# EAGLE design stm32-shield (EAGLE 9.6.2)
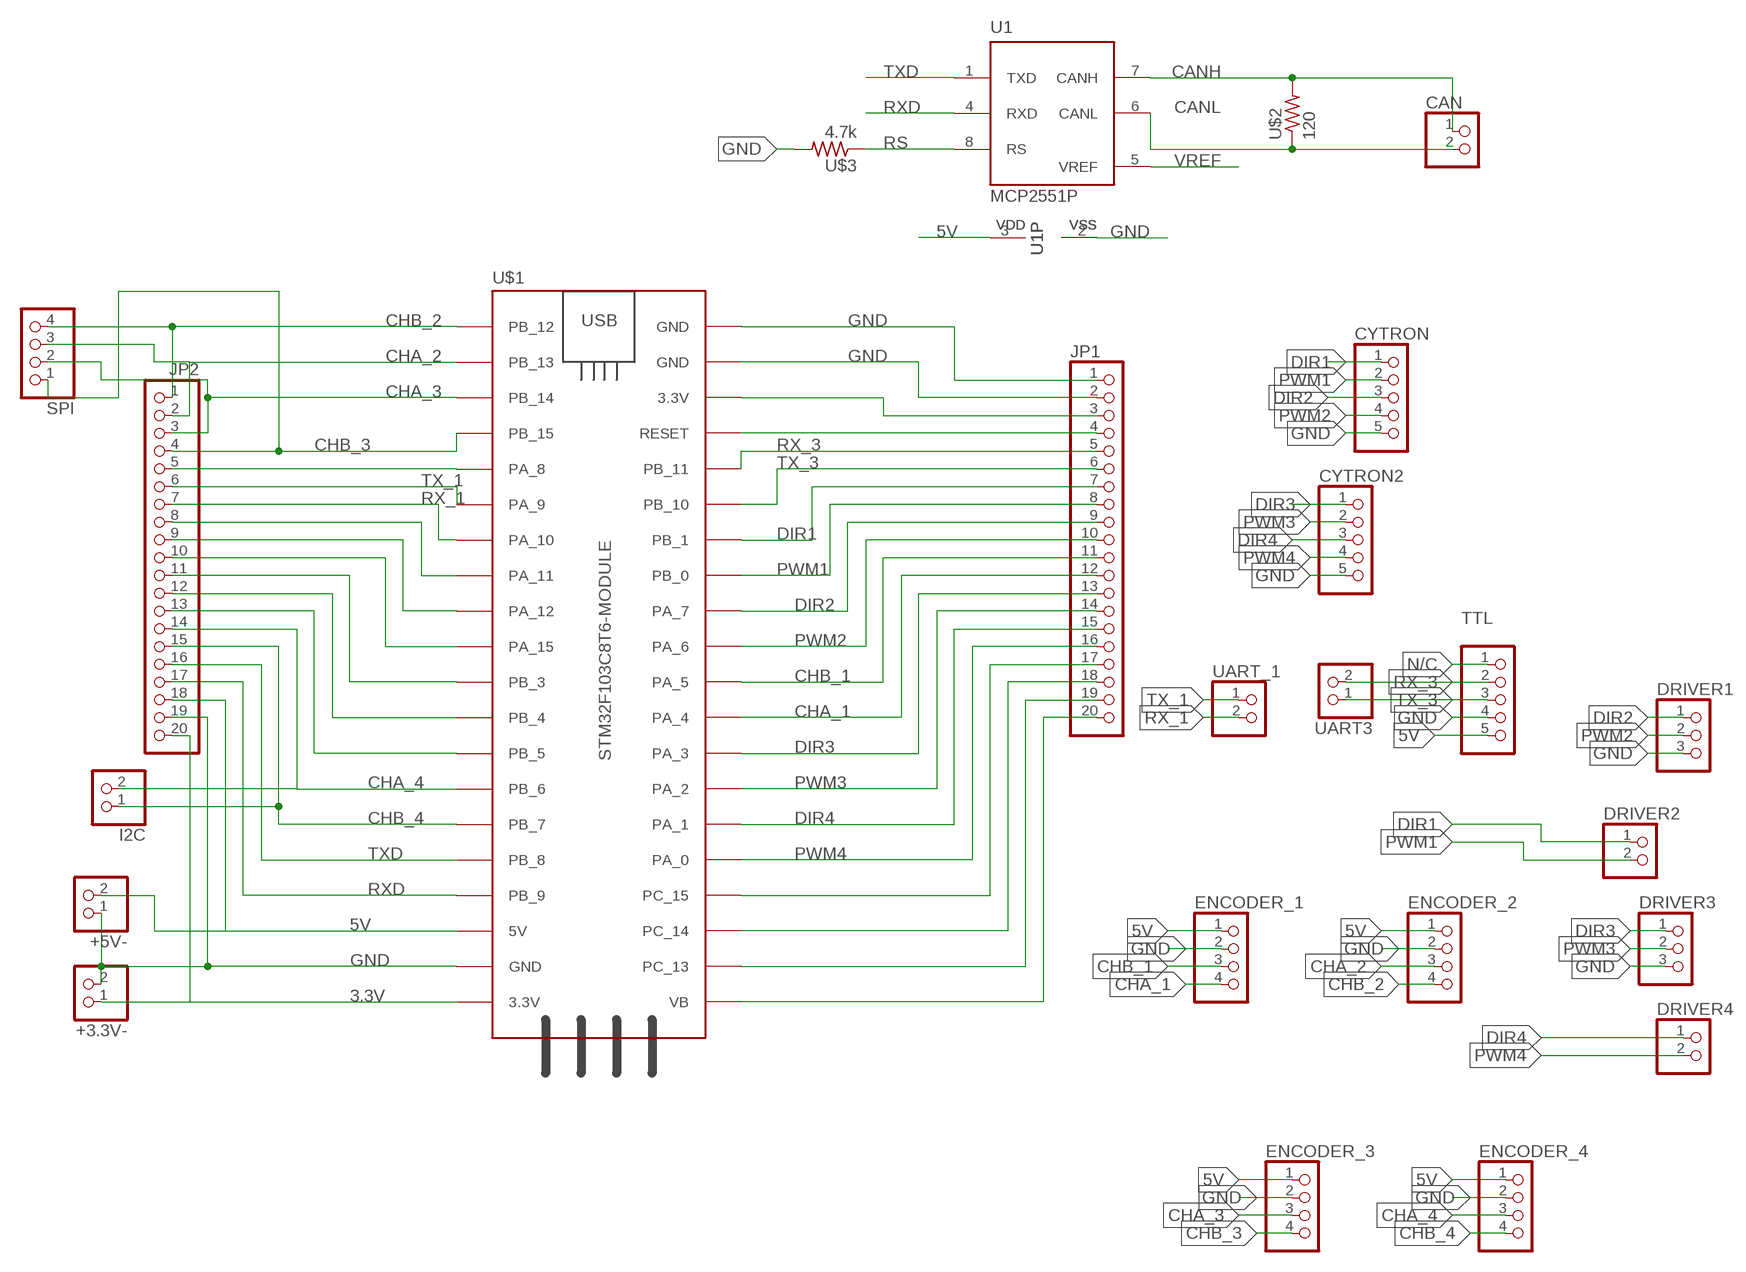
[diagram p0: schematic, sheet 1]

## Parts
+3.3V-  PINHD-2_DATA  [1X02_DATA]
+5V-  PINHD-2_DATA  [1X02_DATA]
CAN  PINHD-2_DATA  [1X02_DATA]
CYTRON  PINHD-5_DATA  [1X05_DATA]
CYTRON2  PINHD-5_DATA  [1X05_DATA]
DRIVER1  PINHD-3_DATA  [1X03_DATA]
DRIVER2  PINHD-2_DATA  [1X02_DATA]
DRIVER3  PINHD-3_DATA  [1X03_DATA]
DRIVER4  PINHD-2_DATA  [1X02_DATA]
ENCODER_1  PINHD-4_DATA  [1X04_DATA]
ENCODER_2  PINHD-4_DATA  [1X04_DATA]
ENCODER_3  PINHD-4_DATA  [1X04_DATA]
ENCODER_4  PINHD-4_DATA  [1X04_DATA]
I2C  PINHD-2_DATA  [1X02_DATA]
JP1  PINHD-1X20  [1X20]
JP2  PINHD-1X20  [1X20]
SPI  PINHD-4_DATA  [1X04_DATA]
TTL  PINHD-5_DATA  [1X05_DATA]
U1  MCP2551P  [DIL8]
U$1  STM32F103C8T6-MODULE  [STM32F103C8T6-MODULE]
U$2  120  RES-7  [0204/7]
U$3  4.7k  RES-7  [0204/7]
UART3  PINHD-2_DATA  [1X02_DATA]
UART_1  PINHD-2_DATA  [1X02_DATA]

## Nets
3.3V: +3.3V-.1 JP2.20 U$1.3.3V_1(3.3V)
5V: +5V-.2 ENCODER_1.1 ENCODER_2.1 ENCODER_3.1 ENCODER_4.1 JP2.18 TTL.5 U1.3(VDD) U$1.5V
ADADA: JP2.5 U$1.PA_8
ARQRQ: JP2.13 U$1.PB_5
CANH: CAN.1 U1.7(CANH) U$2.2
CANL: CAN.2 U1.6(CANL) U$2.1
CHA_1: ENCODER_1.4 JP1.12 U$1.PA_4
CHA_2: ENCODER_2.3 JP2.2 SPI.3 U$1.PB_13
CHA_3: ENCODER_3.3 JP2.3 SPI.2 U$1.PB_14
CHA_4: ENCODER_4.3 I2C.2 JP2.14 U$1.PB_6
CHB_1: ENCODER_1.3 JP1.11 U$1.PA_5
CHB_2: ENCODER_2.4 JP2.1 SPI.4 U$1.PB_12
CHB_3: ENCODER_3.4 JP2.4 SPI.1 U$1.PB_15
CHB_4: ENCODER_4.4 I2C.1 JP2.15 U$1.PB_7
DIR1: CYTRON.1 DRIVER2.1 JP1.7 U$1.PB_1
DIR2: CYTRON.3 DRIVER1.1 JP1.9 U$1.PA_7
DIR3: CYTRON2.1 DRIVER3.1 JP1.13 U$1.PA_3
DIR4: CYTRON2.3 DRIVER4.1 JP1.15 U$1.PA_1
GND: +3.3V-.2 +5V-.1 CYTRON2.5 CYTRON.5 DRIVER1.3 DRIVER3.3 ENCODER_1.2 ENCODER_2.2 ENCODER_3.2 ENCODER_4.2 JP1.1 JP1.2 JP2.19 TTL.4 U1.2(VSS) U$1.GND_1(GND) U$1.GND_2(GND) U$1.GND_3(GND) U$3.2
N$3: JP1.3 U$1.3.3V_2(3.3V)
N$4: JP1.4 U$1.RESET
N$17: JP1.17 U$1.PC_15
N$18: JP1.18 U$1.PC_14
N$19: JP1.19 U$1.PC_13
N$20: JP1.20 U$1.VB
N$28: JP2.8 U$1.PA_11
N$29: JP2.9 U$1.PA_12
N$30: JP2.10 U$1.PA_15
N$31: JP2.11 U$1.PB_3
N$32: JP2.12 U$1.PB_4
N/C: TTL.1
PWM1: CYTRON.2 DRIVER2.2 JP1.8 U$1.PB_0
PWM2: CYTRON.4 DRIVER1.2 JP1.10 U$1.PA_6
PWM3: CYTRON2.2 DRIVER3.2 JP1.14 U$1.PA_2
PWM4: CYTRON2.4 DRIVER4.2 JP1.16 U$1.PA_0
RS: U1.8(RS) U$3.1
RX_1: JP2.7 U$1.PA_10 UART_1.2
RX_3: JP1.5 TTL.2 U$1.PB_11 UART3.2
RXD: JP2.17 U1.4(RXD) U$1.PB_9
TX_1: JP2.6 U$1.PA_9 UART_1.1
TX_3: JP1.6 TTL.3 U$1.PB_10 UART3.1
TXD: JP2.16 U1.1(TXD) U$1.PB_8
VREF: U1.5(VREF)

## Library data of the parts
+3.3V- +5V- CAN DRIVER2 DRIVER4 I2C UART3 UART_1 = MIA_LIBRARY-2-2-2:PINHD-2_DATA: PIN HEADER
CYTRON CYTRON2 TTL = MIA_LIBRARY-2-2-2:PINHD-5_DATA: PIN HEADER
DRIVER1 DRIVER3 = MIA_LIBRARY-2-2-2:PINHD-3_DATA: PIN HEADER
ENCODER_1-ENCODER_4 SPI = MIA_LIBRARY-2-2-2:PINHD-4_DATA: PIN HEADER
JP1 JP2 = pinhead:PINHD-1X20: PIN HEADER
U1 = MIA_LIBRARY-2-2-2:MCP2551: High Speed CAN tranceiver
U$1 = MIA_LIBRARY-2-2-2:STM32F103C8T6-MODULE: STM32F103C8T6 module with ARM Cortex-3, 20kB SRAM, 64kB Flash, 72MHz
U$2 U$3 = MIA_LIBRARY-2-2-2:RES-7

## Board
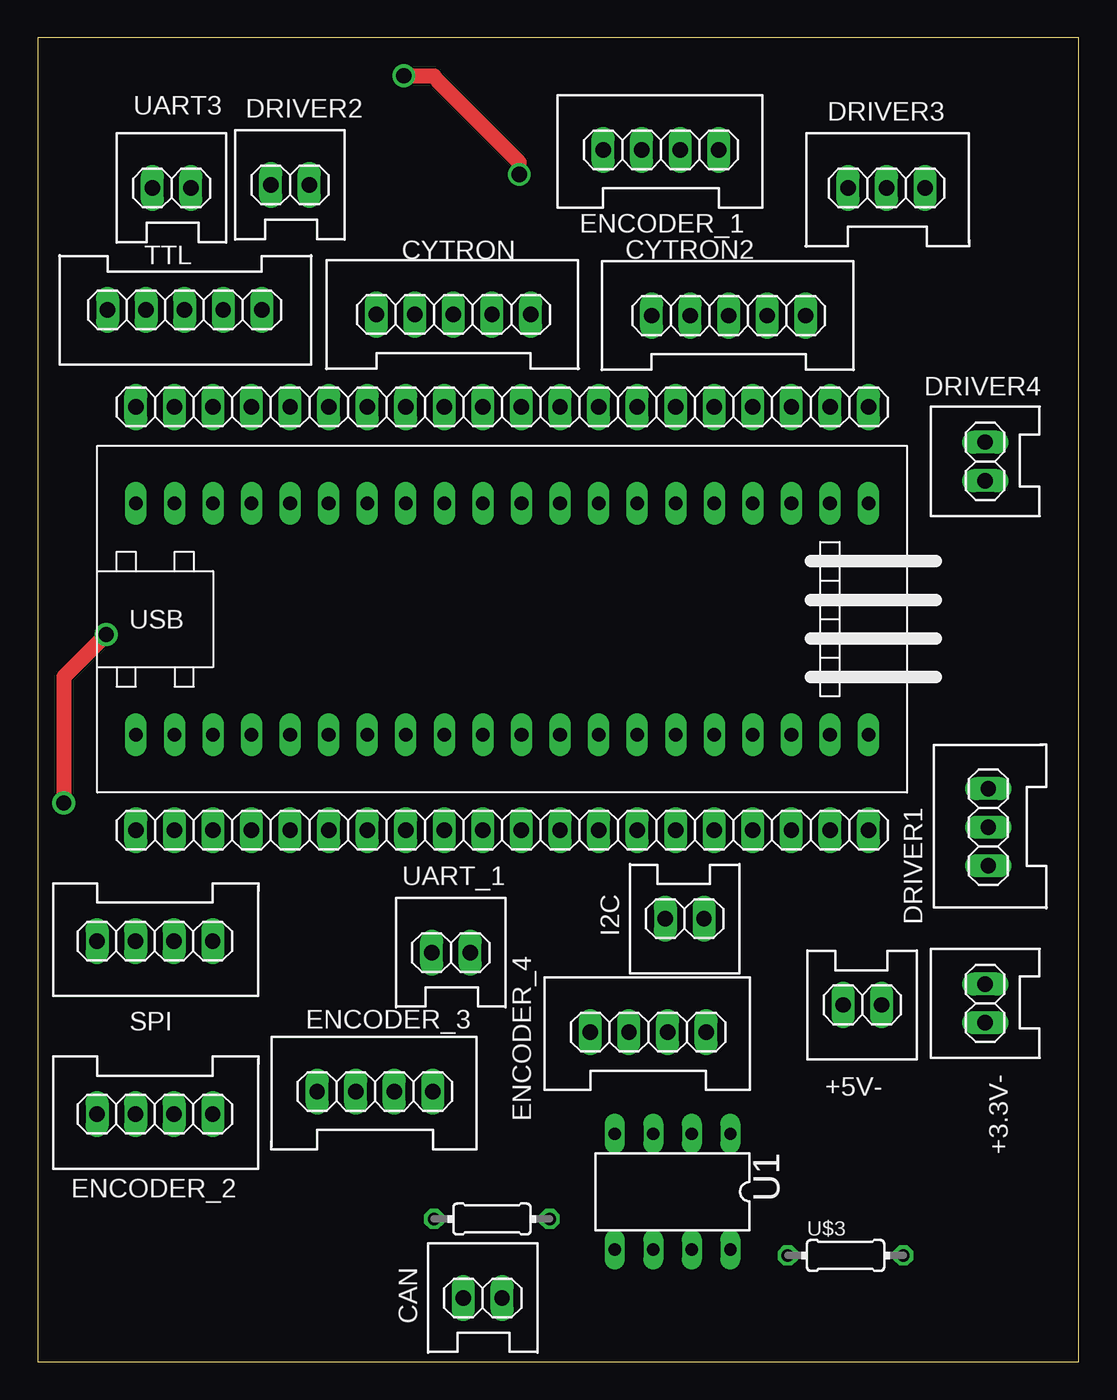
[diagram p1: board, top side]
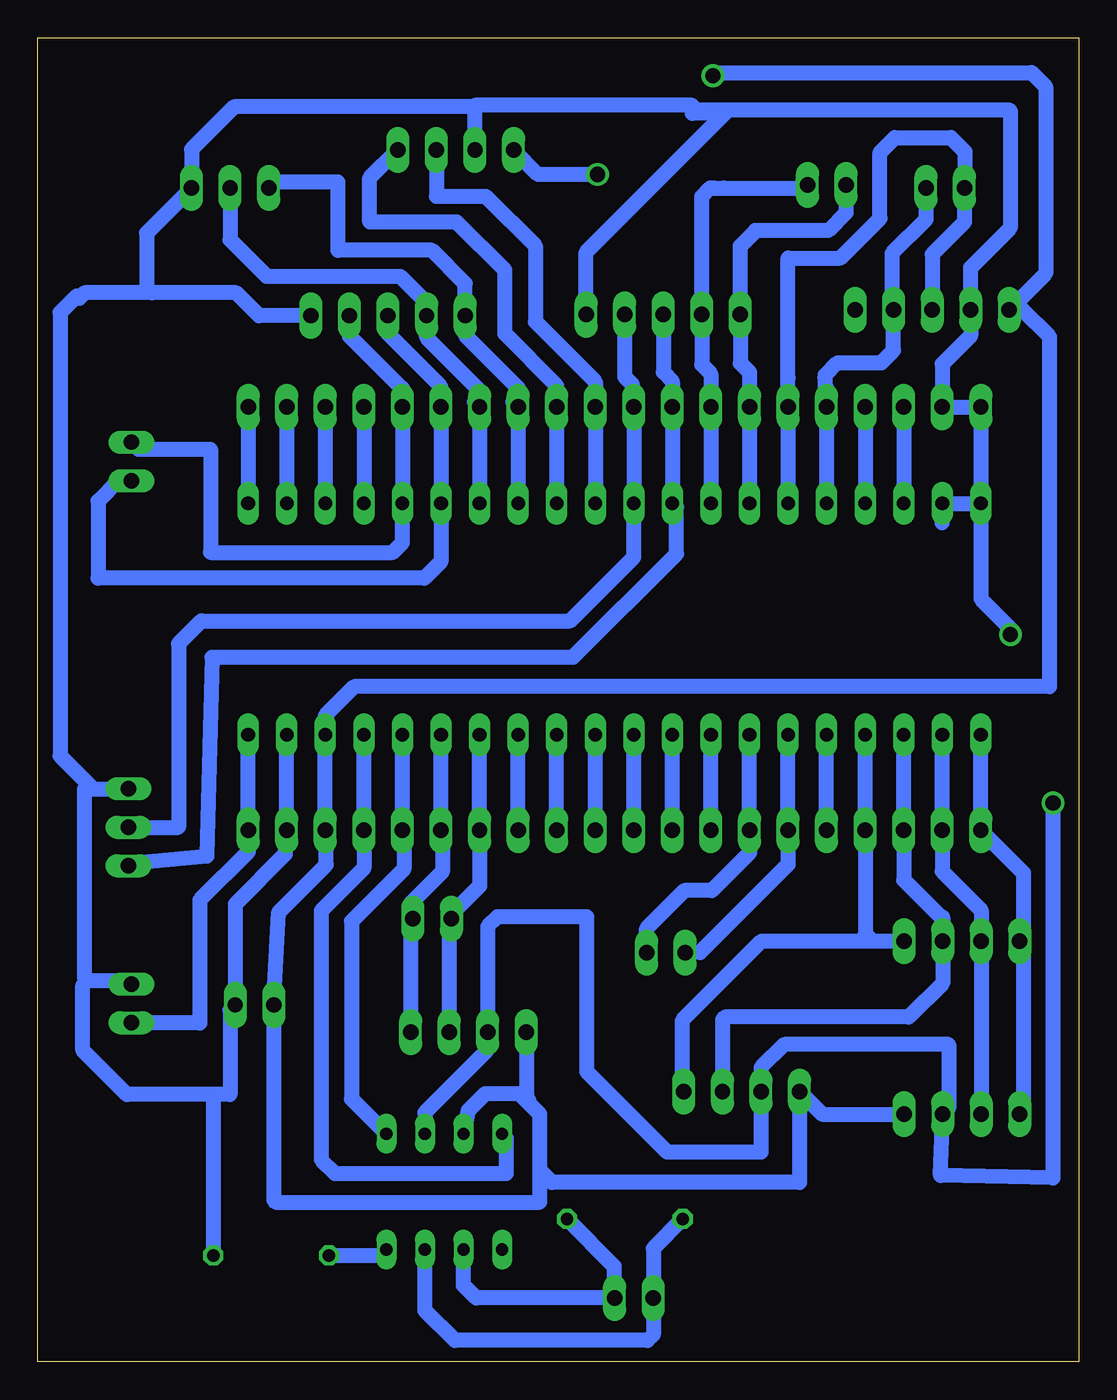
[diagram p2: board, bottom side, seen from below]

Size 68.56 x 87.18 mm. Coordinates in mm from the lower left corner, seen from the top.
Outline: 0,0 68.56,0 68.56,87.18 0,87.18 0,0
Copper layers (1*16): Top 0.035mm / dielectric 1.5mm / Bottom 0.035mm
Design rules "default *": minimum track width 1mm, minimum drill 1mm, track to track 0.8mm, track to pad 0.8mm, pad to pad 6mil, via to via 6mil, smd to smd 6mil, copper to edge 0.8mm, drill to drill 0.8mm, minimum pad ring 10mil, minimum via ring 8mil, stop-mask expansion 4mil, vias tented up to drill 0mil, thermal gap 10mil

### Footprints (pad centres in the part's own frame; a part is rotated, then mirrored left to right if it is on the bottom)
1X02_DATA = drill 1.016 long: 1 -1.27,0; 2 1.27,0
1X05_DATA = drill 1.016 long: 1 -5.08,0; 2 -2.54,0; 3 0,0; 4 2.54,0; 5 5.08,0
1X03_DATA = drill 1.016 long: 1 -2.54,0; 2 0,0; 3 2.54,0
1X04_DATA = drill 1.016 long: 1 -3.81,0; 2 -1.27,0; 3 1.27,0; 4 3.81,0
1X20 = drill 1.016 long: 1 -24.13,0; 2 -21.59,0; 3 -19.05,0; 4 -16.51,0; 5 -13.97,0; 6 -11.43,0; 7 -8.89,0; 8 -6.35,0; 9 -3.81,0; 10 -1.27,0; 11 1.27,0; 12 3.81,0; 13 6.35,0; 14 8.89,0; 15 11.43,0; 16 13.97,0; 17 16.51,0; 18 19.05,0; 19 21.59,0; 20 24.13,0
DIL8 = drill 0.813 long: 1 -3.81,-3.81; 2 -1.27,-3.81; 3 1.27,-3.81; 4 3.81,-3.81; 5 3.81,3.81; 6 1.27,3.81; 7 -1.27,3.81; 8 -3.81,3.81
STM32F103C8T6-MODULE = drill 0.9 long: 3.3V_1 25.4,-7.62; 3.3V_2 -17.78,7.62; 5V 20.32,-7.62; GND_1 22.86,-7.62; GND_2 -20.32,7.62; GND_3 -22.86,7.62; PA_0 15.24,7.62; PA_1 12.7,7.62; PA_2 10.16,7.62; PA_3 7.62,7.62; PA_4 5.08,7.62; PA_5 2.54,7.62; PA_6 0,7.62; PA_7 -2.54,7.62; PA_8 -12.7,-7.62; PA_9 -10.16,-7.62; PA_10 -7.62,-7.62; PA_11 -5.08,-7.62; PA_12 -2.54,-7.62; PA_15 0,-7.62; PB_0 -5.08,7.62; PB_1 -7.62,7.62; PB_3 2.54,-7.62; PB_4 5.08,-7.62; PB_5 7.62,-7.62; PB_6 10.16,-7.62; PB_7 12.7,-7.62; PB_8 15.24,-7.62; PB_9 17.78,-7.62; PB_10 -10.16,7.62; PB_11 -12.7,7.62; PB_12 -22.86,-7.62; PB_13 -20.32,-7.62; PB_14 -17.78,-7.62; PB_15 -15.24,-7.62; PC_13 22.86,7.62; PC_14 20.32,7.62; PC_15 17.78,7.62; RESET -15.24,7.62; VB 25.4,7.62
0204/7 = drill 0.813 octagon: 1 -3.81,0; 2 3.81,0

### Placement (x,y rotation side)
+3.3V-  62.4,23.59 90 top
+5V-  54.3,23.49 180 top
CAN  29.3,4.19 0 top
CYTRON  27.37,68.96 0 top
CYTRON2  45.5,68.89 0 top
DRIVER1  62.6,35.19 90 top
DRIVER2  16.6,77.49 0 top
DRIVER3  55.9,77.29 0 top
DRIVER4  62.4,59.29 90 top
ENCODER_1  41.04,79.81 0 top
ENCODER_2  7.7,16.29 180 top
ENCODER_3  22.2,17.79 0 top
ENCODER_4  40.2,21.69 0 top
I2C  42.6,29.17 180 top
JP1  30.58,62.87 0 top
JP2  30.58,34.99 0 top
SPI  7.7,27.69 180 top
TTL  9.66,69.26 180 top
U1  41.8,11.19 180 top
U$1  29.31,48.9 0 top
U$2  29.9,9.39 180 top
U$3  53.2,6.99 0 top
UART3  8.8,77.29 0 top
UART_1  27.2,26.94 0 top

### Tracks (layer width: path | path; a pad name or v marks a point on that pad's centre or on a via)
3.3V
  Bottom 1: JP2.20 U$1.3.3V_1 | 54.81,34.89 JP2.20 | JP2.20 54.71,33.58 57.9,30.39 57.9,22.29 62.37,22.29 +3.3V-.1
5V  (via drill 1)
  Top 1: v24.1,84.69 26.11,84.69 26.33,84.36 31.7,78.99 v31.7,78.19
  Bottom 1: v24.1,84.69 23.9,84.89 3.1,84.89 2.18,83.97 2.18,71.66 TTL.5 3.67,69.26 1.91,67.5 1.91,44.46 47.72,44.46 49.63,42.55 U$1.5V JP2.18 49.57,33.79 49.57,32.72 52.7,29.59 +5V-.2 53.03,10.62 52.9,10.49 35.5,10.49 35.5,12.59 | v31.7,78.19 35.61,78.19 ENCODER_1.1 | U1.3 40.49,15 40.2,16.55 39.09,17.66 36.87,17.66 36.43,17.22 | 36.43,17.22 36.21,17.22 36.39,17.4 ENCODER_4.1 | 36.43,17.22 35.5,16.29 35.5,12.59 | ENCODER_2.1 16.89,16.29 ENCODER_3.1 18.39,11.8 18.4,11.79 34.7,11.79 35.5,12.59
ADADA
  Bottom 1: JP2.5 U$1.PA_8
ARQRQ
  Bottom 1: JP2.13 U$1.PB_5
CANH
  Bottom 1: U$2.2 28.03,7.45 CAN.1 28.03,1.76 28.4,1.39 41.1,1.39 43.07,3.36 U1.7
CANL
  Bottom 1: U$2.1 30.6,6.28 30.6,4.49 30.7,4.39 30.7,4.06 CAN.2 39.7,4.19 40.53,5.02 U1.6
CHA_1
  Bottom 1: U$1.PA_4 JP1.12 34.39,64.28 37.8,67.69 37.8,71.89 40.97,75.06 46.7,75.06 46.7,77.96 ENCODER_1.4
CHA_2
  Bottom 1: U$1.PB_13 JP2.2 8.99,32.29 6.43,29.73 SPI.3 | SPI.3 ENCODER_2.3 | 6.6,27.69 SPI.3
CHA_3
  Bottom 1: JP2.3 U$1.PB_14 | JP2.3 11.7,34.82 | ENCODER_3.3 23.47,22.52 23.3,22.69 11.2,22.69 8.97,24.92 SPI.2 8.97,29.26 9,29.29 9.1,29.29 11.53,31.72 JP2.3
CHA_4
  Bottom 1: U$1.PB_6 JP2.14 39.47,31.32 41.47,29.32 41.47,29.17 | 41.47,29.17 ENCODER_4.3 | 41.1,29.17 I2C.2 41.47,29.17
CHB_1
  Bottom 1: JP1.11 U$1.PA_5 | JP1.11 32.1,63.12 | ENCODER_1.3 42.31,76.75 39.07,76.75 35.8,73.49 35.8,68.49 31.85,64.54 JP1.11
CHB_2
  Bottom 1: U$1.PB_12 JP2.1 3.65,32.19 3.65,27.69 | ENCODER_2.4 3.65,16.53 3.65,27.69 | 4.1,27.69 SPI.4 3.65,27.69
CHB_3
  Bottom 1: JP2.4 U$1.PB_15 | JP2.4 14.1,34.96 | ENCODER_3.4 26.1,17.88 26.1,22.49 20.9,27.69 13.6,27.69 | 13.6,27.69 SPI.1 | JP2.4 14.07,28.16 13.6,27.69
CHB_4
  Bottom 1: U$1.PB_7 JP2.15 41.91,34.89 41.91,32.28 44.01,30.18 44.01,29.17 | 44.01,29.17 44.01,28.69 | 44.01,28.69 ENCODER_4.4 | 44.01,29.17 I2C.1 | 44.1,28.69 44.01,28.69
DIR1
  Bottom 1: U$1.PB_1 JP1.7 21.69,65.16 22.29,65.76 CYTRON.1 22.29,73.48 21.28,74.49 | 21.3,74.51 21.28,74.49 | DRIVER2.1 15.33,75.66 16.5,74.49 21.28,74.49
DIR2
  Bottom 1: CYTRON.3 27.37,65.16 26.77,64.56 JP1.9 U$1.PA_7 26.5,56.25 26.5,53.19 33.3,46.39 57.1,46.39 57.44,33.29 62.4,32.85 DRIVER1.1
DIR3
  Bottom 1: JP1.13 U$1.PA_3 | JP1.13 37.28,63.22 | JP1.13 36.93,64.12 40.42,67.61 CYTRON2.1 40.42,71.01 42.6,73.19 48.8,73.19 48.8,77.69 52.96,77.69 DRIVER3.1
DIR4
  Bottom 1: CYTRON2.3 45.5,67.69 42.01,64.2 JP1.15 U$1.PA_1 42.01,52.68 43.1,51.59 64.6,51.59 64.6,56.69 63.27,58.02 DRIVER4.1
GND  (via drill 1)
  Top 1: v4.5,47.89 1.7,45.09 v1.7,36.79
  Bottom 1: 25.48,82.42 25.48,82.74 39.77,82.74 39.77,82.64 | 25.48,82.42 25.48,82.22 23.3,82.22 26.65,78.86 32.45,73.06 CYTRON.5 | U$1.GND_3 U$1.GND_2 8.99,55.25 | U$1.GND_3 JP1.1 JP1.2 8.99,65.7 7.12,67.57 TTL.4 7.12,72.06 4.52,74.66 4.52,82.42 25.48,82.42 | U$1.GND_1 JP2.19 52.27,34.89 52.27,33.42 55.57,30.12 +5V-.1 55.91,23.15 55.91,17.59 57.01,17.59 | ENCODER_1.2 39.77,82.64 | 39.77,82.64 55.65,82.64 58.44,79.85 DRIVER3.3 61.4,74.33 61.4,70.75 61.04,70.39 | U1.2 43.07,16.41 39,20.47 39,21.62 ENCODER_4.2 38.93,28.66 38.3,29.29 32.4,29.29 32.4,19.09 27.1,13.79 20.93,13.79 ENCODER_3.2 20.93,19.36 19.4,20.89 8.57,20.89 8.57,16.69 ENCODER_2.2 9.1,12.26 1.7,12.09 v1.7,36.79 | 57.01,17.59 U$3.2 | 63.3,24.99 63.3,25.09 | 63.3,25.09 62.63,25.09 +3.3V-.2 | DRIVER1.3 62.64,37.69 64.9,37.69 | 64.9,37.69 65.5,37.69 65.5,25.29 65.3,25.09 | 57.01,17.59 62.7,17.59 65.6,20.49 65.6,24.79 65.3,25.09 | 65.3,25.09 63.3,25.09 | 64.9,37.69 67.1,39.89 67.1,69.09 66,70.19 65.84,70.03 65.48,70.39 61.04,70.39 | CYTRON2.5 54,68.89 55.5,70.39 61.04,70.39 | U$1.GND_3 6.45,50.24 4.5,48.29 v4.5,47.89
N$3
  Bottom 1: JP1.3 U$1.3.3V_2
N$4
  Bottom 1: JP1.4 U$1.RESET
N$17
  Bottom 1: JP1.17 U$1.PC_15
N$18
  Bottom 1: JP1.18 U$1.PC_14
N$19
  Bottom 1: JP1.19 U$1.PC_13
N$20
  Bottom 1: JP1.20 U$1.VB
N$28
  Bottom 1: JP2.8 U$1.PA_11
N$29
  Bottom 1: JP2.9 U$1.PA_12
N$30
  Bottom 1: JP2.10 U$1.PA_15
N$31
  Bottom 1: JP2.11 U$1.PB_3
N$32
  Bottom 1: JP2.12 U$1.PB_4
PWM1
  Bottom 1: U$1.PB_0 JP1.8 24.23,65.06 24.83,65.66 CYTRON.2 24.83,76.74 24.28,77.29 24.04,77.29 23.4,77.29 18.07,77.29 DRIVER2.2
PWM2
  Bottom 1: CYTRON.4 29.91,64.86 29.41,64.36 29.41,62.97 JP1.10 U$1.PA_6 29.31,52.98 33.5,48.79 57.8,48.79 59.3,47.29 59.3,35.19 DRIVER1.2
PWM3
  Bottom 1: JP1.14 U$1.PA_2 | JP1.14 39.82,63.22 | JP1.14 39.47,63.96 42.96,67.45 CYTRON2.2 42.8,69.05 42.8,69.59 44.7,71.49 53.5,71.49 55.9,73.89 DRIVER3.2
PWM4
  Bottom 1: JP1.16 U$1.PA_0 44.55,53.94 45.2,53.29 57.2,53.29 57.2,60.09 61.93,60.09 DRIVER4.2 | JP1.16 44.55,64.14 | JP1.16 44.55,64.04 48.04,67.53 CYTRON2.4
RS
  Bottom 1: U$3.1 46,6.99 U1.8
RX_1
  Bottom 1: U$1.PA_10 JP2.7 21.69,33.5 24.18,31.02 25.98,31.02 28.47,28.52 UART_1.2
RX_3
  Bottom 1: JP1.5 U$1.PB_11 | JP1.5 16.61,64.14 | JP1.5 16.72,62.98 16.72,64.69 16.71,64.98 15.9,65.79 13,65.79 12.2,66.59 TTL.2 12.3,69.36 12.3,72.99 10.07,75.22 UART3.2
RXD
  Bottom 1: U$1.PB_9 JP2.17 47.09,32.5 49.9,29.69 49.9,13.29 49,12.39 37.7,12.39 37.7,14.71 U1.4
TX_1
  Bottom 1: U$1.PA_9 JP2.6 19.15,32.74 24.95,26.94 UART_1.1
TX_3
  Bottom 1: JP1.6 U$1.PB_10 | JP1.6 19.15,64.78 | JP1.6 19.15,72.69 15.7,72.69 13.1,75.29 13.1,79.64 12.12,80.61 8.42,80.61 7.5,79.69 7.5,77.32 UART3.1 7.53,75.06 9.66,72.93 TTL.3
TXD
  Bottom 1: U$1.PB_8 JP2.16 44.45,34.89 44.45,32.44 47.9,28.99 47.9,17.29 U1.1